# Altium schematic sheet Sheet2 -.SchDoc
size A4; CheckedBy: Senuda Ratnayake; Author: Ravindu Tennakoon; SheetNumber: 1; SheetTotal: 1
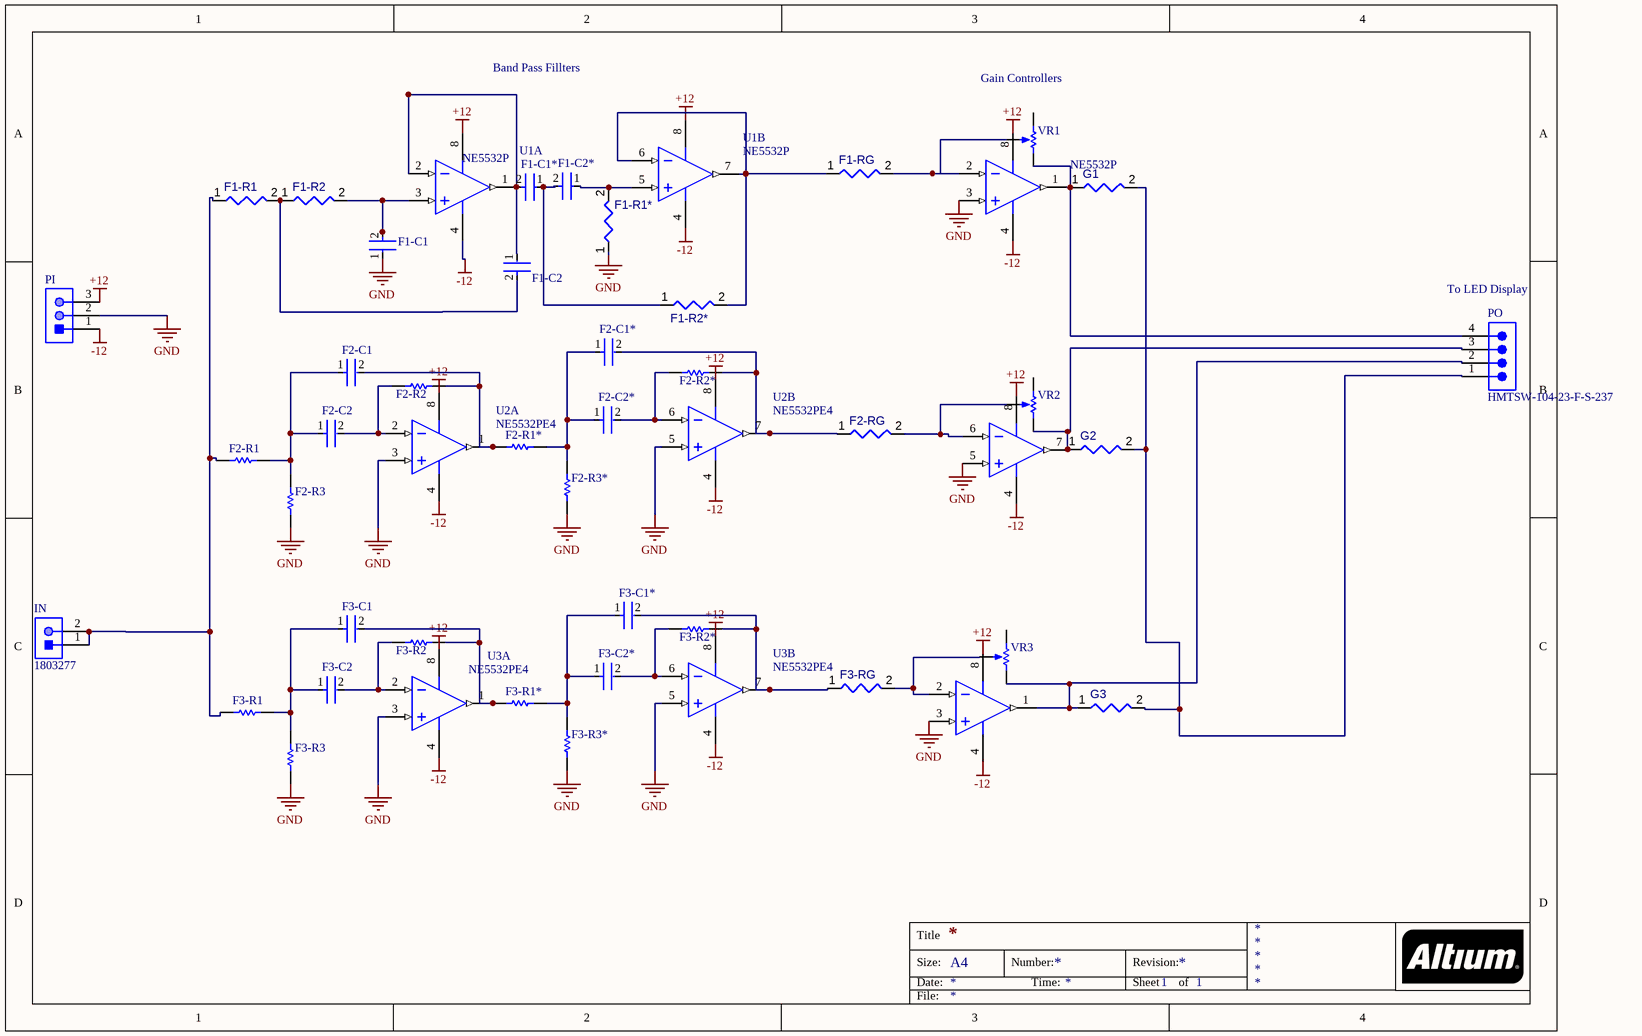
[diagram p0: Sheet2 -.SchDoc]

## Parts
F1-C1  VY1102M35Y5UQ6TV0  [FP-VY1102M35Y5UQ6TV0-MFG]  (value not drawn)
F1-C1*  VY1102M35Y5UQ6TV0  [FP-VY1102M35Y5UQ6TV0-MFG]  (value not drawn)
F1-C2  VY1102M35Y5UQ6TV0  [FP-VY1102M35Y5UQ6TV0-MFG]  (value not drawn)
F1-C2*  VY1102M35Y5UQ6TV0  [FP-VY1102M35Y5UQ6TV0-MFG]  (value not drawn)
F1-R1  MFR-25FBF52-2K21  [RESA60-630X240]  (value not drawn)
F1-R1*  MFR-25FBF52-2K21  [RESA60-630X240]  (value not drawn)
F1-R2  MFR-25FBF52-2K21  [RESA60-630X240]  (value not drawn)
F1-R2*  MFR-25FBF52-2K21  [RESA60-630X240]  (value not drawn)
F1-RG  MFR-25FBF52-2K21  [RESA60-630X240]  (value not drawn)
F2-C1  VY2102M29Y5US6TV7  [FP-VY2102M29Y5US6TV7-MFG]  (value not drawn)
F2-C1*  VY2102M29Y5US6TV7  [FP-VY2102M29Y5US6TV7-MFG]  (value not drawn)
F2-C2  VY2102M29Y5US6TV7  [FP-VY2102M29Y5US6TV7-MFG]  (value not drawn)
F2-C2*  VY2102M29Y5US6TV7  [FP-VY2102M29Y5US6TV7-MFG]  (value not drawn)
F2-R1  MFR-25FBF52-2K21  [RESA60-630X240]  (value not drawn)
F2-R1*  MFR-25FBF52-2K21  [RESA60-630X240]  (value not drawn)
F2-R2  MFR-25FBF5210K  [RESA60-630X240]  (value not drawn)
F2-R2*  MFR-25FBF5210K  [RESA60-630X240]  (value not drawn)
F2-R3  MFR-25FBF5210K  [RESA60-630X240]  (value not drawn)
F2-R3*  MFR-25FBF5210K  [RESA60-630X240]  (value not drawn)
F2-RG  MFR-25FBF52-2K21  [RESA60-630X240]  (value not drawn)
F3-C1  VY2102M29Y5US6TV7  [FP-VY2102M29Y5US6TV7-MFG]  (value not drawn)
F3-C1*  VY2102M29Y5US6TV7  [FP-VY2102M29Y5US6TV7-MFG]  (value not drawn)
F3-C2  VY2102M29Y5US6TV7  [FP-VY2102M29Y5US6TV7-MFG]  (value not drawn)
F3-C2*  VY2102M29Y5US6TV7  [FP-VY2102M29Y5US6TV7-MFG]  (value not drawn)
F3-R1  MFR-25FBF52-2K21  [RESA60-630X240]  (value not drawn)
F3-R1*  MFR-25FBF52-2K21  [RESA60-630X240]  (value not drawn)
F3-R2  MFR-25FBF5210K  [RESA60-630X240]  (value not drawn)
F3-R2*  MFR-25FBF5210K  [RESA60-630X240]  (value not drawn)
F3-R3  MFR-25FBF5210K  [RESA60-630X240]  (value not drawn)
F3-R3*  MFR-25FBF5210K  [RESA60-630X240]  (value not drawn)
F3-RG  MFR-25FBF52-2K21  [RESA60-630X240]  (value not drawn)
G1  MFR-25FBF52-2K21  [RESA60-630X240]  (value not drawn)
G2  MFR-25FBF52-2K21  [RESA60-630X240]  (value not drawn)
G3  MFR-25FBF52-2K21  [RESA60-630X240]  (value not drawn)
IN  1803277  [PHOE-1803277_V]
PI  B3P-VH(LF)(SN)  [JST-B3P-VH(LF)(SN)-3_V]  (value not drawn)
PO  HMTSW-104-23-F-S-237  [SMTC-HMTSW-104-23-X-S-237]
U1  NE5532P  [P0008A]  (parts A,B of 2)
U2  NE5532PE4  [TI-P8]  (parts A,B of 2)
U3  NE5532PE4  [TI-P8]  (parts A,B of 2)
U4  NE5532P  [P0008A]  (parts A,B of 2)
U5  NE5532P  [P0008A]  (value not drawn)  (part A of 2)
VR1  3852A-282-103AL  [BOUR-3852A-282-103AL-3_V]  (value not drawn)
VR2  3852A-282-103AL  [BOUR-3852A-282-103AL-3_V]  (value not drawn)
VR3  3852A-282-103AL  [BOUR-3852A-282-103AL-3_V]  (value not drawn)

## Nets
+12: PI.3 U1.8(VCC+) U2.8(VCC+) U3.8(VCC+) U4.8(VCC+) U5.8(VCC+)
-12: PI.1 U1.4(VCC-) U2.4(VCC-) U3.4(VCC-) U4.4(VCC-) U5.4(VCC-)
GND: F1-C1.1 F1-R1*.1 F2-R3.1 F2-R3*.1 F3-R3.1 F3-R3*.1 PI.2 U2.3(IN1+) U2.5(IN2+) U3.3(IN1+) U3.5(IN2+) U4.3(IN1+) U4.5(IN2+) U5.3(IN1+)
NetF1-C1*_1: F1-C1*.1 F1-C2*.2 F1-R2*.1
NetF1-C1*_2: F1-C1*.2 F1-C2.1 U1.1(OUT1) U1.2(IN1-)
NetF1-C1_2: F1-C1.2 F1-R2.2 U1.3(IN1+)
NetF1-C2*_1: F1-C2*.1 F1-R1*.2 U1.5(IN2+)
NetF1-C2_2: F1-C2.2 F1-R1.2 F1-R2.1
NetF1-R1_1: F1-R1.1 F2-R1.1 F3-R1.1 IN.1 IN.2
NetF1-R2*_2: F1-R2*.2 F1-RG.1 U1.6(IN2-) U1.7(OUT2)
NetF1-RG_2: F1-RG.2 U4.2(IN1-) VR1.2(S)
NetF2-C1*_1: F2-C1*.1 F2-C2*.1 F2-R1*.2 F2-R3*.2
NetF2-C1*_2: F2-C1*.2 F2-R2*.1 F2-RG.1 U2.7(OUT2)
NetF2-C1_1: F2-C1.1 F2-C2.1 F2-R1.2 F2-R3.2
NetF2-C1_2: F2-C1.2 F2-R1*.1 F2-R2.1 U2.1(OUT1)
NetF2-C2*_2: F2-C2*.2 F2-R2*.2 U2.6(IN2-)
NetF2-C2_2: F2-C2.2 F2-R2.2 U2.2(IN1-)
NetF2-RG_2: F2-RG.2 U4.6(IN2-) VR2.2(S)
NetF3-C1*_1: F3-C1*.1 F3-C2*.1 F3-R1*.2 F3-R3*.2
NetF3-C1*_2: F3-C1*.2 F3-R2*.1 F3-RG.1 U3.7(OUT2)
NetF3-C1_1: F3-C1.1 F3-C2.1 F3-R1.2 F3-R3.2
NetF3-C1_2: F3-C1.2 F3-R1*.1 F3-R2.1 U3.1(OUT1)
NetF3-C2*_2: F3-C2*.2 F3-R2*.2 U3.6(IN2-)
NetF3-C2_2: F3-C2.2 F3-R2.2 U3.2(IN1-)
NetF3-RG_2: F3-RG.2 U5.2(IN1-) VR3.2(S)
NetG1_1: G1.1 PO.4 U4.1(OUT1) VR1.3(CW)
NetG1_2: G1.2 G2.2 G3.2 PO.1
NetG2_1: G2.1 PO.3 U4.7(OUT2) VR2.3(CW)
NetG3_1: G3.1 PO.2 U5.1(OUT1) VR3.3(CW)

Not connected (* = marked no-connect by the designer): VR1 1(CCW); VR2 1(CCW); VR3 1(CCW)

## Notes on the sheet
- Band Pass Fillters
- (near VR1) Gain Controllers
- (near PO) To LED Display
- Title
- Size:
- Date:
- A4
- Number:
- Time:
- Revision:
- Sheet
- of
- File:

## Library data of the parts
F1-C1 F1-C1* F1-C2 F1-C2* = CMP-02417-000063-1: CAP CER 1000PF 760VAC Y5U RADIAL; Voltage: 500V; Capacitance: 1nF; Lead Diameter: 0.6mm; Lead/Base Style: Kinked; Tolerance: 20%; Construction: RADIAL; Dielectric: Y5U; RoHS Compliant: Yes; Resistor Type: Ceramic; Min Operating Temperature: -40°C; Height - Seated (Max): 0.512inch; Series: VY1; Diameter: 9mm; Voltage Rating (AC): 500V; Termination: Radial; Depth: 5mm; Radiation Hardening: No; Lead Pitch: 10mm; Package Quantity: 500; Case/Package: Radial; Height: 12mm; Contact Plating: Tin; Voltage Rating (DC): 500V; Max Operating Temperature: 125°C; Packaging: Tape and Reel; Mount: Through Hole
F1-R1 F1-R1* F1-R2 F1-R2* F1-RG F2-RG F3-RG G1-G3 = CMP-009-00054-4: Axial Resistor, 2.21 KOhm, +/- 1%, 0.25 W, -55 to 155 degC, 2-Pin THD, RoHS, Bulk; Manufacturer: Yageo; Voltage Rating: 250V; Power: 250mW; Value: 2.21k; Tolerance: 1%; Package Reference: MFR-25; Packaging: Bulk; Datasheet Version: Apr-13; Manufacturer URL: http://www.yageo.com/; Package Description: 2-Pin Axial Lead, Dia 2.4 mm, Body Length 6.3 mm; Mounting Technology: TH; RoHS Compliant: True; Package Quantity: 200; Min Operating Temperature: -55°C; Case/Package: Axial; Max Operating Temperature: 155°C; Datasheet URL: http://www.yageo.com/documents/recent/Yageo%20LR_MFR_2013.pdf
F2-C1 F2-C1* F2-C2 F2-C2* F3-C1 F3-C1* F3-C2 F3-C2* = CMP-00030-42817980-1: VY2102M29Y5US6TV7 Cap Ceramic Suppression X1/Y2 0.001uF 440VAC/300VAC Y5U 20% (7.5 X 5mm) Radial 7.5mm 125C T/R; Capacitance: 1nF; Lead/Base Style: Kinked; Lead Diameter: 600µm; Voltage: 300V; Voltage Rating: 1kV; Case/Package: Radial; Height: 10.5mm; REACH SVHC: Unknown; Packaging: Tape & Reel (TR); Lead Free: Lead Free; RoHS: Compliant; Min Operating Temperature: -40°C; Max Operating Temperature: 125°C; Termination: Radial; Composition: Ceramic; Depth: 5mm; Dielectric: Y5U; Diameter: 7.5mm; Lead Pitch: 7.5mm; Schedule B: 8532230060, 8532230060; Radiation Hardening: No; Tolerance: 20%; Height - Seated (Max): 11.5062mm; Voltage Rating (AC): 300V; Material: Ceramic; Mount: Through Hole; NexarPartId: 42817980
F2-R1 F2-R1* F3-R1 F3-R1* = CMP-1659-00065-1: Axial Resistor, 2.21 KOhm, +/- 1%, 0.25 W, -55 to 155 degC, 2-Pin THD, RoHS, Bulk; Case\Package: 0402; Current Rating: 300 mA; Shielding: Unshielded; Resistance: 0.15 Ohm; Radiation Hardening: No; Mount: Surface Mount; REACH SVHC: No SVHC; Height: 0.02 inch; ComponentLink1URL: http://www.yageo.com/; Case Code (Imperial): 0402; ComponentLink2Description: Datasheet; ComponentLink1Description: Manufacturer URL; Max Operating Temperature: 125 degC; DatasheetVersion: Apr-13; PackageReference: MFR-25; RoHSCompliant: true; PackageDescription: 2-Pin Axial Lead, Dia 2.4 mm, Body Length 6.3 mm; ComponentLink2URL: http://www.yageo.com/documents/recent/Yageo%20LR_MFR_2013.pdf; Pins: 2; Length: 0.04 inch; Case Code (Metric): 1005; Packaging: Tape and Reel; Width: 0.02 inch; Min Operating Temperature: -55 degC; Package Quantity: 10000
F2-R2 F2-R2* F2-R3 F2-R3* F3-R2 F3-R2* F3-R3 F3-R3* = CMP-1659-00074-2: Axial Resistor, 10 KOhm, +/- 1%, 0.25 W, -55 to 155 degC, 2-Pin THD, RoHS, Bulk; Manufacturer: Yageo; Temperature Coefficient: 100ppm\/degreesC; Voltage Rating: 250V; Voltage Rating (DC): 200V; Resistance: 10KOhm; Max Power Dissipation: 250mW; Datasheet URL: http://www.yageo.com/documents/recent/Yageo%20LR_MFR_2013.pdf; Packaging: Bulk; RoHSCompliant: True; Mount: ThroughHole; Package Reference: MFR-25; Termination: Axial; Composition: MetalFilm; Number of Terminations: 2; Package Quantity: 200; Mounting Technology: ThroughHole; Length: 0.248inch; Max Operating Temperature: 155degC; Min Operating Temperature: -55degC; Datasheet Version: 04/2013; Lead Free: LeadFree; Manufacturer URL: http://www.yageo.com/; Tolerance: 1%; Power Rating: 250mW; Package Description: 2-Pin Axial Lead, Dia 2.4 mm, Body Length 6.3 mm; Military Standard: Not; Case\/Package: Axial
IN = CMP-002-00014-2: Male Header, Pitch 3.81 mm, 1 x 2 Position, Height 7.25 mm, Tail Length 3.4 mm, RoHS, Bulk; Manufacturer: Phoenix Contact; Voltage Rating: 160V; Current Rating: 8A; Rows: 1; Mounting Technology: TH; Contact Plating: Tin; Case/Package: 1803277; Gender: Male; Diameter: 7.25mm; Datasheet Version: Feb-14; Colour: Green; Pins: 2; Lead Pitch: 0.15inch; Connector Type: Header; Package Quantity: 50; Max Current Rating: 8A; Manufacturer URL: http://www.phoenixcontact.com/; Packaging: Bulk; RoHS Compliant: True; Datasheet URL: https://datasheet.ciiva.com/16096/1803277-16096845.pdf; Package Reference: 1803277; Package Description: Male Header, Pitch 3.81 mm, 1 x 2 Position, Height 7.25 mm, Tail Length 3.4 mm
PI = CMP-002-00026-2: Male Header, Pitch 3.96 mm, 1 x 3 Position, Height 10.9 mm, Tail Length 3.7 mm, -25 to 85 degC, RoHS, Bulk; Manufacturer: JST; Case/Package: B3P-VH(LF)(SN); Connector Type: Header; Datasheet Version: May-16; Mounting Technology: TH; Package Description: Male Header, Pitch 3.96 mm, 1 x 3 Position, Height 10.9 mm, Tail Length 3.7 mm; Gender: Male; Manufacturer URL: http://www.jst.com/home2.html; Package Reference: B3P-VH(LF)(SN); Datasheet URL: http://www.jst-mfg.com/product/pdf/eng/eVH.pdf; Min Operating Temperature: -25°C; Max Operating Temperature: 85°C; RoHS Compliant: Unknown
PO = CMP-1024-00021-1: Modified .025" SQ Post Header, Through-hole, Vertical, -55 to 125 degC, 2.54 mm Pitch, 4-Pin, Male, RoHS; Manufacturer: Samtec; Pitch: 2.54 mm; PackageReference: HMTSW-104-23-X-S-237; ComponentLink2URL: http://www.samtec.com/documents/webfiles/pdf/HMTSW.PDF; ComponentLink3Description: Package Specification; PartNumber: HMTSW-104-23-F-S-237; RoHS: True; ComponentLink2Description: Datasheet; Temperature Range: -55 to 125 degC; ComponentLink1Description: Manufacturer URL; DatasheetVersion: F-214; PackageDescription: Assembly .025 [.64] SQ. Post Hi-Temp Terminal Strip; Orientation: Vertical; PackageVersion: AL, 3/1987; Mounting Technology: Through-hole; ComponentLink1URL: http://www.samtec.com; ComponentLink3URL: http://www.samtec.com/documents/webfiles/cpdf/HMTSW-XXX-XX-X-X-XXXX-XX-XX-MKT1.pdf
U1 U4 U5 = CMP-0017-00910-2: Dual Low-Noise High-Speed Audio Operational Amplifier, 10 to 30 V, 0 to 70 degC, 8-pin DIP (P8), Pb-Free (RoHS); Manufacturer: Texas Instruments; Iq per channel(Max)(mA): 4; Slew Rate(Typ)(V/us): 9; Vn at 1kHz(Typ)(nV/rtHz): 5; IIB(Max)(pA): 800000; Total Supply Voltage(Max)(+5V is 5, +/-5V is 10): 30; GBW(Typ)(MHz): 10; CMRR(Min)(dB): 70; Number of Channels: 2; Sub Family: General Purpose Amplifier, High Supply Voltage Amplifier (>=30V), Low Noise Amp (<=10nV/rtHz); ComponentLink2URL: http://www.ti.com/lit/ds/symlink/ne5532.pdf; PackageReference: P0008A; PackageDescription: 8-Pin Plastic In-Line, Body 9.59 x 6.35 mm, Pitch 2.54 mm; ComponentLink1Description: Manufacturer URL; Eco-Plan: Pb-Free (RoHS); Mounting Technology: Through Hole; Code_JEDEC: MS-001; PackageVersion: 4040082/E, 04/2010; DatasheetVersion: SLOS075I; ComponentLink3URL: http://www.ti.com/litv/pdf/mpdi001b; ComponentLink2Description: Datasheet; Vio (25C)(Max)(mV): 4; PartNumber: NE5532P; ComponentLink3Description: Package Specification; Total Supply Voltage(Min)(+5V is 5, +/-5V is 10): 10; ComponentLink1URL: http://www.ti.com/
U2 U3 = CMP-0017-00902-1: Dual Low-Noise High-Speed Audio Operational Amplifier, 10 to 30 V, 0 to 70 degC, 8-pin DIP (P8), Pb-Free (RoHS); Manufacturer: Texas Instruments; CMRR(Min)(dB): 70; IIB(Max)(pA): 800000; Sub Family: General Purpose Amplifier, High Supply Voltage Amplifier (>=30V), Low Noise Amp (<=10nV/rtHz); Vn at 1kHz(Typ)(nV/rtHz): 5; Total Supply Voltage(Min)(+5V is 5, +/-5V is 10): 10; Slew Rate(Typ)(V/us): 9; Vio (25C)(Max)(mV): 4; Total Supply Voltage(Max)(+5V is 5, +/-5V is 10): 30; Number of Channels: 2; PackageDescription: 8-Pin Plastic In-Line, Body 9.59 x 6.35 mm, Pitch 2.54 mm; ComponentLink1URL: http://www.ti.com/; Code_JEDEC: MS-001; GBW(Typ)(MHz): 10; Eco-Plan: Pb-Free (RoHS); ComponentLink2URL: http://www.ti.com/lit/ds/symlink/ne5532.pdf; Mounting Technology: Through Hole; DatasheetVersion: SLOS075I; ComponentLink1Description: Manufacturer URL; ComponentLink3URL: http://www.ti.com/litv/pdf/mpdi001b; PartNumber: NE5532PE4; PackageVersion: 4040082/E, 04/2010; ComponentLink2Description: Datasheet; ComponentLink3Description: Package Specification; Iq per channel(Max)(mA): 4; PackageReference: P8
VR1-VR3 = CMP-2000-05079-1: Diameter Panel Control, 10 KOhm, +/- 10%, 2 W, -1 to 125 degC, 3-Pin THD, RoHS, Bulk; Manufacturer: Bourns; Temperature Coefficient: ±150ppm/degC; Number of Gangs: 1; Other Names: 3852A282103AL; Actuator Length: 0.875"(22.23mm); Resistive Material: Cermet; PCN Design/Specification: PBTResinJun/2011; Rotation: 280deg; PCN Other: MultipleChanges01/Dec/2012; Catalog Drawings: 3852SeriesSide1 / 3852SeriesSide2; Online Catalog: 3852and3856Series; Associated Product: 36-8560-ND / -KNOBINSTRUMW/DIALRND.9"DIA / 36-8555-ND / -KNOBINSTRUMSKIRTEDRND.7"DIA / 36-8556-ND / -KNOBINSTRUMSKIRTEDRND.9"DIA / 36-8565-ND / -KNOBINSTRUMDBLBARRND.7"DIA / 36-8566-ND / -KNOBINSTRUMDBLBARRND.9"DIA / 36-8568-ND / -KNOBINSTRUMSGLBARRND.7"DIA / 36-8569-ND / -KNOBINSTRUMSGLBARRND.9"DIA / 36-8559-ND / -KNOBINSTRUMW/DIALRND.7"DIA / 226-1006-ND / -KNOBBLKGLOSS.75"DIA.250"SHAFT / 226-1007-ND / -KNOBBLKGLOSS.925"DIA.250"SHAFT / 226-1011-ND / -KNOBBLKGLOS; Actuator Diameter: 0.250"(6.35mm); Built in Switch: None; Resistance (Ohms): 10k; Power (Watts): 2W; Actuator Type: Slotted; Standard Package: 45; Tolerance: ±10%; Taper: Linear; Series: 3852; Packaging: Bulk; Category: Potentiometers,VariableResistors; Bushing Thread: 3/8-32; Datasheet URL: https://datasheet.ciiva.com/11831/0900766b80f93b4b-11831016.pdf; Datasheet Version: Sep-14; Number of Turns: 1; Family: RotaryPotentiometers,Rheostats; Termination Style: SolderLug; RoHS Information: 3852A-LMaterialDeclaration; Mounting Type: PanelMount; Manufacturer URL: http://www.bourns.com/